# EAGLE design Temperaturmessung_NTC (EAGLE 7.6.0)
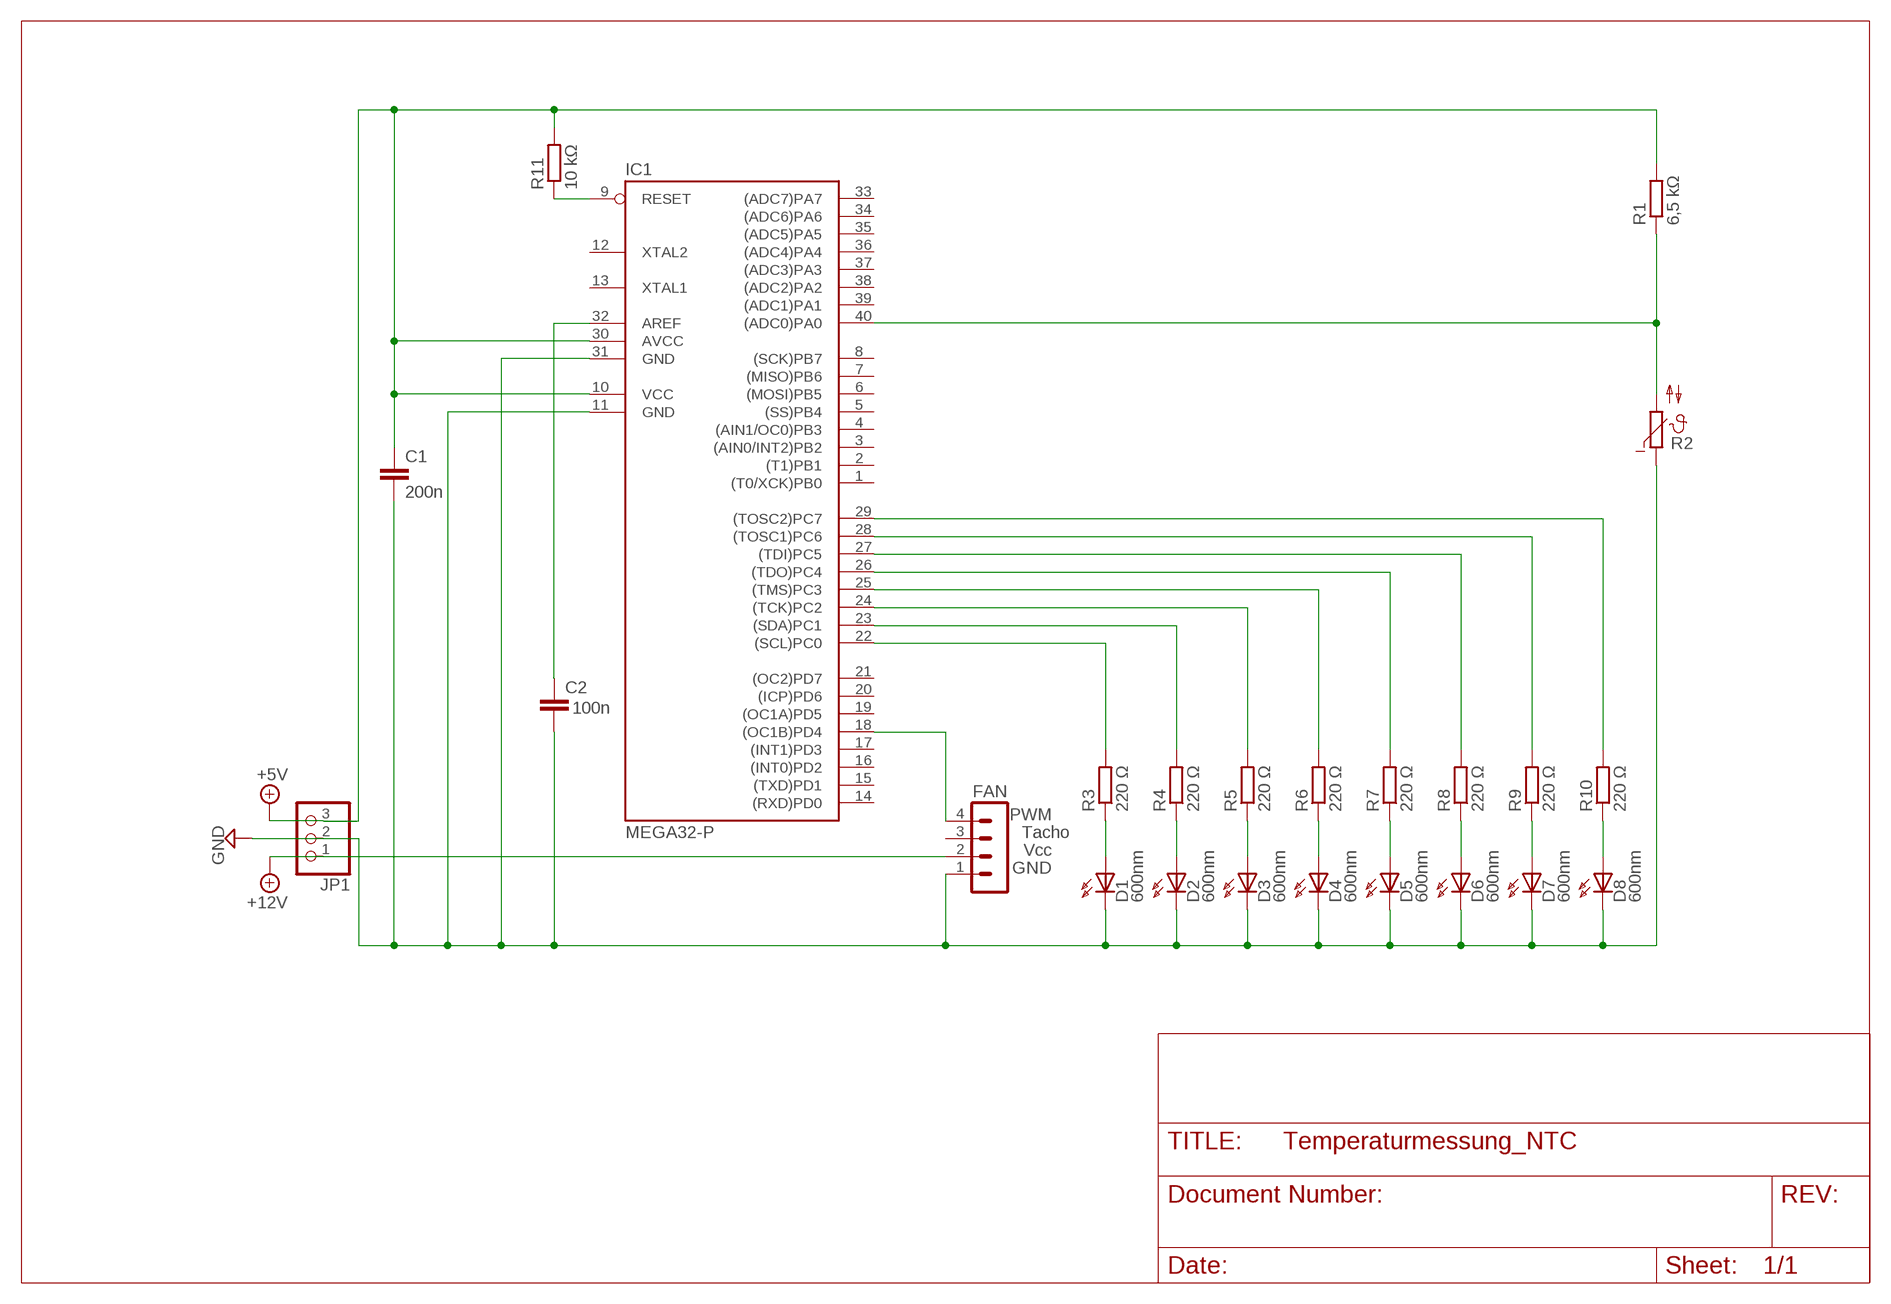
[diagram p0: schematic, sheet 1]

## Parts
C1  200n  C2.5/2  [C2.5-2]
C2  C2.5/2  [C2.5-2]
D1  600nm  HLMP6  [HLMP6]
D2  600nm  HLMP6  [HLMP6]
D3  600nm  HLMP6  [HLMP6]
D4  600nm  HLMP6  [HLMP6]
D5  600nm  HLMP6  [HLMP6]
D6  600nm  HLMP6  [HLMP6]
D7  600nm  HLMP6  [HLMP6]
D8  600nm  HLMP6  [HLMP6]
FAN  MA04-1  [MA04-1]
IC1  MEGA32-P  [DIL40]
JP1  PINHD-1X3/90  [1X03/90]
R1  6,5 kΩ  R-EU_0309/12  [0309/12]
R2  NTC644A  [N644A]
R3  220 Ω  R-EU_0309/12  [0309/12]
R4  220 Ω  R-EU_0309/12  [0309/12]
R5  220 Ω  R-EU_0309/12  [0309/12]
R6  220 Ω  R-EU_0309/12  [0309/12]
R7  220 Ω  R-EU_0309/12  [0309/12]
R8  220 Ω  R-EU_0309/12  [0309/12]
R9  220 Ω  R-EU_0309/12  [0309/12]
R10  220 Ω  R-EU_0309/12  [0309/12]
R11  10 kΩ  R-EU_0309/12  [0309/12]

## Nets
+5V: C1.1 IC1.10(VCC) IC1.30(AVCC) JP1.3 R1.2 R11.2
+12V: FAN.2 JP1.1
GND: C1.2 C2.2 D1.K D2.K D3.K D4.K D5.K D6.K D7.K D8.K FAN.1 IC1.11(GND) IC1.31(GND) JP1.2 R2.1
N$1: IC1.22((SCL)PC0) R3.2
N$2: IC1.40((ADC0)PA0) R1.1 R2.2
N$3: FAN.4 IC1.18((OC1B)PD4)
N$4: IC1.23((SDA)PC1) R4.2
N$5: C2.1 IC1.32(AREF)
N$6: IC1.24((TCK)PC2) R5.2
N$7: IC1.25((TMS)PC3) R6.2
N$8: IC1.26((TDO)PC4) R7.2
N$9: IC1.27((TDI)PC5) R8.2
N$10: IC1.28((TOSC1)PC6) R9.2
N$11: IC1.29((TOSC2)PC7) R10.2
N$12: D1.A R3.1
N$13: D2.A R4.1
N$14: D3.A R5.1
N$15: D4.A R6.1
N$16: D5.A R7.1
N$17: D6.A R8.1
N$18: D7.A R9.1
N$19: D8.A R10.1
N$20: IC1.9(RESET) R11.1
Unconnected: FAN.3 IC1.1((T0/XCK)PB0) IC1.2((T1)PB1) IC1.3((AIN0/INT2)PB2) IC1.4((AIN1/OC0)PB3) IC1.5((SS)PB4) IC1.6((MOSI)PB5) IC1.7((MISO)PB6) IC1.8((SCK)PB7) IC1.12(XTAL2) IC1.13(XTAL1) IC1.14((RXD)PD0) IC1.15((TXD)PD1) IC1.16((INT0)PD2) IC1.17((INT1)PD3) IC1.19((OC1A)PD5) IC1.20((ICP)PD6) IC1.21((OC2)PD7) IC1.33((ADC7)PA7) IC1.34((ADC6)PA6) IC1.35((ADC5)PA5) IC1.36((ADC4)PA4) IC1.37((ADC3)PA3) IC1.38((ADC2)PA2) IC1.39((ADC1)PA1)

## Library data of the parts
C1 = capacitor-wima:C: CAPACITOR naming: grid - package width
C2 = capacitor-wima:C: CAPACITOR naming: grid - package width; CAP: 100n
D1-D8 = display-hp:HLMP6: LED 2mm horizontal; MF: AGILENT TECHNOLOGIES; MPN: HLMP-6500; OC_FARNELL: 1652490; OC_NEWARK: 40K0088
FAN = con-lstb:MA04-1: PIN HEADER; MF: PWM; MPN: Tacho; OC_FARNELL: Vcc; OC_NEWARK: GND
IC1 = atmel:MEGA32-P: MICROCONTROLLER 32 Kbytes FLASH 2 Kbytes SRAM 1 Kbytes EEPROM USART 8-channel 10 bit ADC Source: www.atmel.com .. doc2503.pdf; MPN: ATMEGA32-16PU; OC_FARNELL: 1661729; OC_NEWARK: 51P1794
JP1 = pinhead:PINHD-1X3: PIN HEADER
R1 R3-R10 = resistor:R-EU_: RESISTOR, European symbol
R2 = ptc-ntc:NTC644A: PHILIPS NTC; OC_FARNELL: unknown; OC_NEWARK: unknown
R11 = rcl:R-EU_: RESISTOR, European symbol

## Board
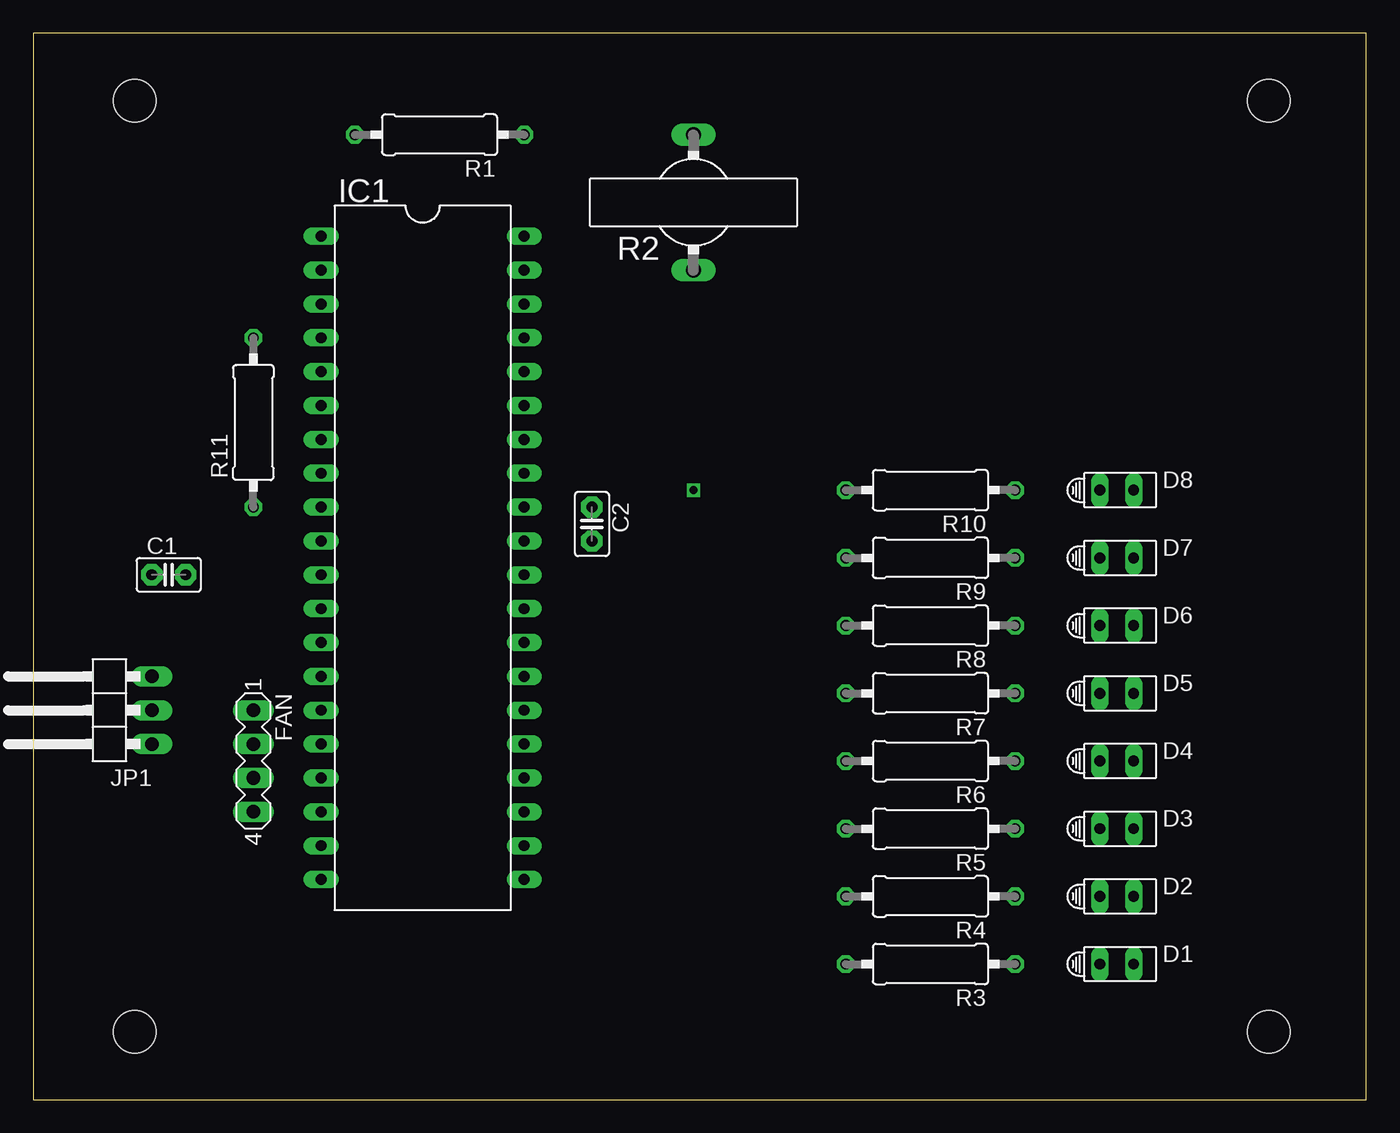
[diagram p1: board, top side]
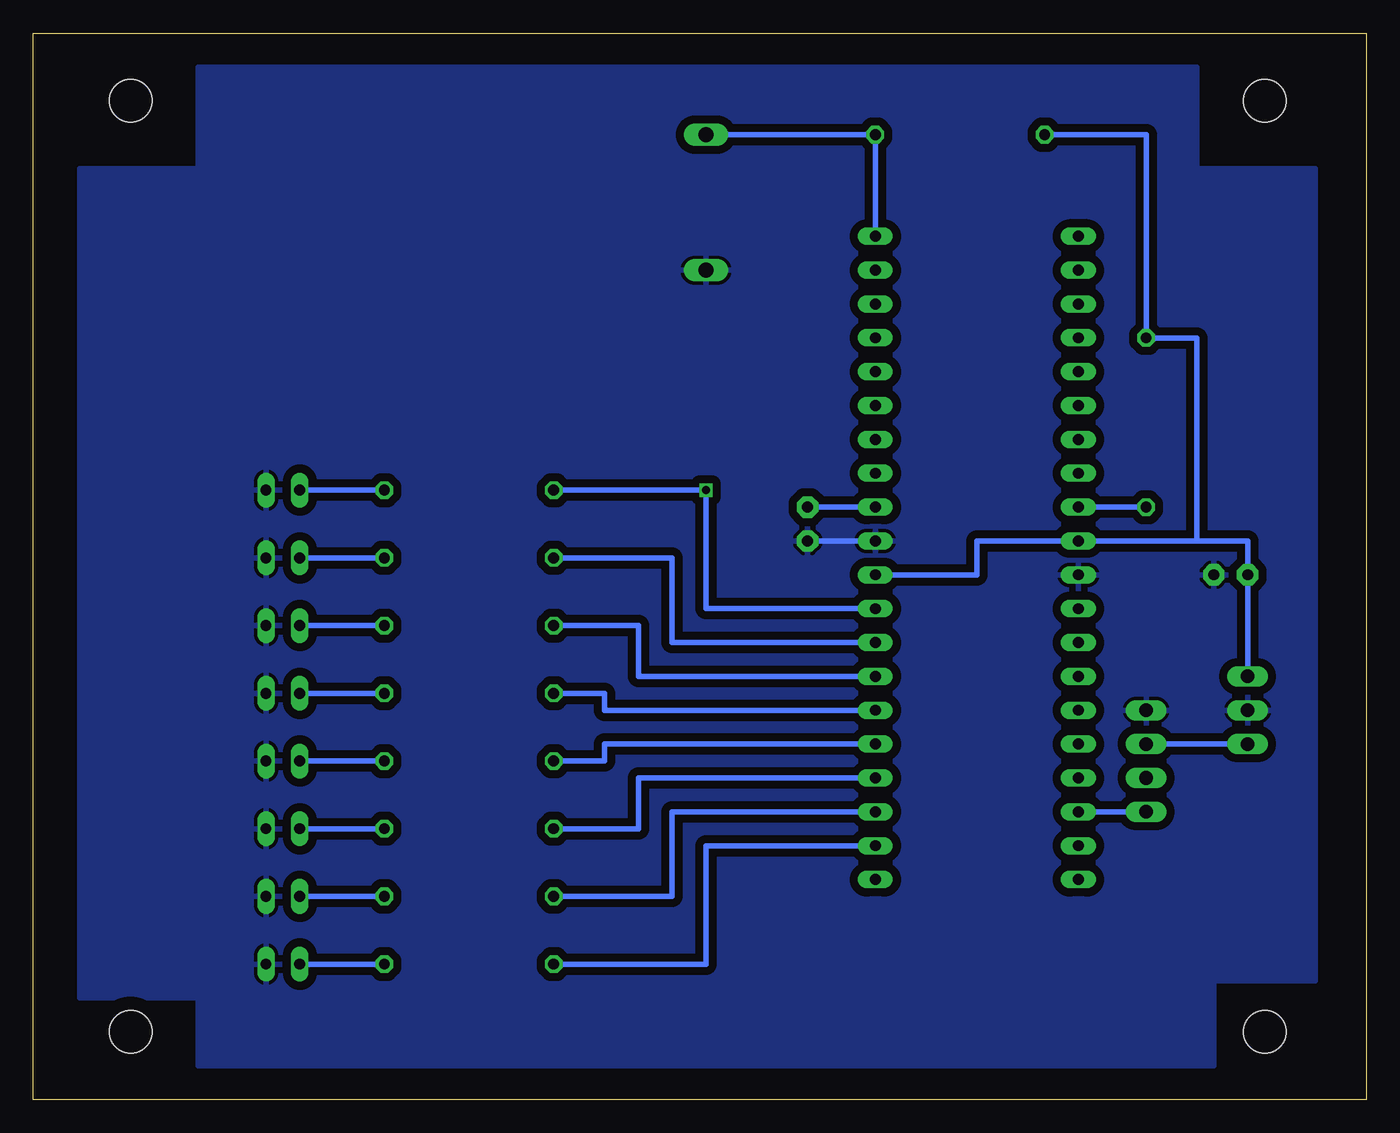
[diagram p2: board, bottom side, seen from below]

Size 100 x 80 mm. Coordinates in mm from the lower left corner, seen from the top.
Outline: 0,0 100,0 100,80 0,80 0,0
Copper layers (1*16): Top 0.035mm / dielectric 1.5mm / Bottom 0.035mm
Design rules "default": minimum track width 10mil, minimum drill 24mil, track to track 8mil, track to pad 8mil, pad to pad 8mil, via to via 8mil, smd to smd 8mil, copper to edge 40mil, drill to drill 8mil, minimum pad ring 10mil, minimum via ring 8mil, stop-mask expansion 4mil, vias tented up to drill 0mil, thermal gap 10mil
Holes 3.2 mm at 7.62,74.93 92.71,74.93 92.71,5.08 7.62,5.08

### Footprints (pad centres in the part's own frame; a part is rotated, then mirrored left to right if it is on the bottom)
C2.5-2 = drill 0.813 pad 1.6 octagon: 1 -1.27,0; 2 1.27,0
HLMP6 = drill 0.813 long: A -1.27,0; K 1.27,0
MA04-1 = drill 1.016 long: 1 -3.81,0; 2 -1.27,0; 3 1.27,0; 4 3.81,0
DIL40 = drill 0.813 long: 1 -24.13,-7.62; 2 -21.59,-7.62; 3 -19.05,-7.62; 4 -16.51,-7.62; 5 -13.97,-7.62; 6 -11.43,-7.62; 7 -8.89,-7.62; 8 -6.35,-7.62; 9 -3.81,-7.62; 10 -1.27,-7.62; 11 1.27,-7.62; 12 3.81,-7.62; 13 6.35,-7.62; 14 8.89,-7.62; 15 11.43,-7.62; 16 13.97,-7.62; 17 16.51,-7.62; 18 19.05,-7.62; 19 21.59,-7.62; 20 24.13,-7.62; 21 24.13,7.62; 22 21.59,7.62; 23 19.05,7.62; 24 16.51,7.62; 25 13.97,7.62; 26 11.43,7.62; 27 8.89,7.62; 28 6.35,7.62; 29 3.81,7.62; 30 1.27,7.62; 31 -1.27,7.62; 32 -3.81,7.62; 33 -6.35,7.62; 34 -8.89,7.62; 35 -11.43,7.62; 36 -13.97,7.62; 37 -16.51,7.62; 38 -19.05,7.62; 39 -21.59,7.62; 40 -24.13,7.62
1X03/90 = drill 1.016 long: 1 -2.54,-3.81; 2 0,-3.81; 3 2.54,-3.81
0309/12 = drill 0.813 octagon: 1 -6.35,0; 2 6.35,0
N644A = drill 1.118 long: 1 -5.08,0; 2 5.08,0

### Placement (x,y rotation side)
C1  10.16,39.37 0 top
C2  41.91,43.18 270 top
D1  81.28,10.16 0 top
D2  81.28,15.24 0 top
D3  81.28,20.32 0 top
D4  81.28,25.4 0 top
D5  81.28,30.48 0 top
D6  81.28,35.56 0 top
D7  81.28,40.64 0 top
D8  81.28,45.72 0 top
FAN  16.51,25.4 270 top
IC1  29.21,40.64 270 top
JP1  5.08,29.21 90 top
R1  30.48,72.39 180 top
R2  49.53,67.31 90 top
R3  67.31,10.16 180 top
R4  67.31,15.24 180 top
R5  67.31,20.32 180 top
R6  67.31,25.4 180 top
R7  67.31,30.48 180 top
R8  67.31,35.56 180 top
R9  67.31,40.64 180 top
R10  67.31,45.72 180 top
R11  16.51,50.8 90 top

### Tracks (layer width: path | path; a pad name or v marks a point on that pad's centre or on a via)
+5V
  Bottom 0.406: IC1.30 29.21,39.37 29.21,41.91 IC1.10 12.7,41.91 | R1.2 16.51,72.39 R11.2 12.7,57.15 12.7,41.91 | 12.7,41.91 8.89,41.91 C1.1 JP1.3
+12V
  Bottom 0.406: JP1.1 FAN.2
GND
  Bottom 0.406: C2.2 IC1.31
  pour Bottom (isolate 0.61): 5.08,69.85 12.7,69.85 12.7,77.47 87.63,77.47 87.63,69.85 96.52,69.85 96.52,7.62 87.63,7.62 87.63,2.54 11.43,2.54 11.43,8.89 3.81,8.89 3.81,69.85
N$1
  Bottom 0.406: IC1.22 49.53,19.05 49.53,10.16 R3.2
N$2
  Bottom 0.406: IC1.40 R1.1 R2.2
N$3
  Bottom 0.406: FAN.4 IC1.18
N$4
  Bottom 0.406: IC1.23 52.07,21.59 52.07,15.24 R4.2
N$5
  Bottom 0.406: IC1.32 C2.1
N$6
  Bottom 0.406: IC1.24 54.61,24.13 54.61,20.32 R5.2
N$7
  Bottom 0.406: IC1.25 57.15,26.67 57.15,25.4 R6.2
N$8
  Bottom 0.406: IC1.26 57.15,29.21 57.15,30.48 R7.2
N$9
  Bottom 0.406: IC1.27 54.61,31.75 54.61,35.56 R8.2
N$10
  Bottom 0.406: IC1.28 52.07,34.29 52.07,40.64 R9.2
N$11  (via drill 0.6)
  Bottom 0.406: IC1.29 49.53,36.83 v49.53,45.72 R10.2
N$12
  Bottom 0.406: R3.1 D1.A
N$13
  Bottom 0.406: R4.1 D2.A
N$14
  Bottom 0.406: R5.1 D3.A
N$15
  Bottom 0.406: R6.1 D4.A
N$16
  Bottom 0.406: R7.1 D5.A
N$17
  Bottom 0.406: R8.1 D6.A
N$18
  Bottom 0.406: R9.1 D7.A
N$19
  Bottom 0.406: R10.1 D8.A
N$20
  Bottom 0.406: R11.1 IC1.9